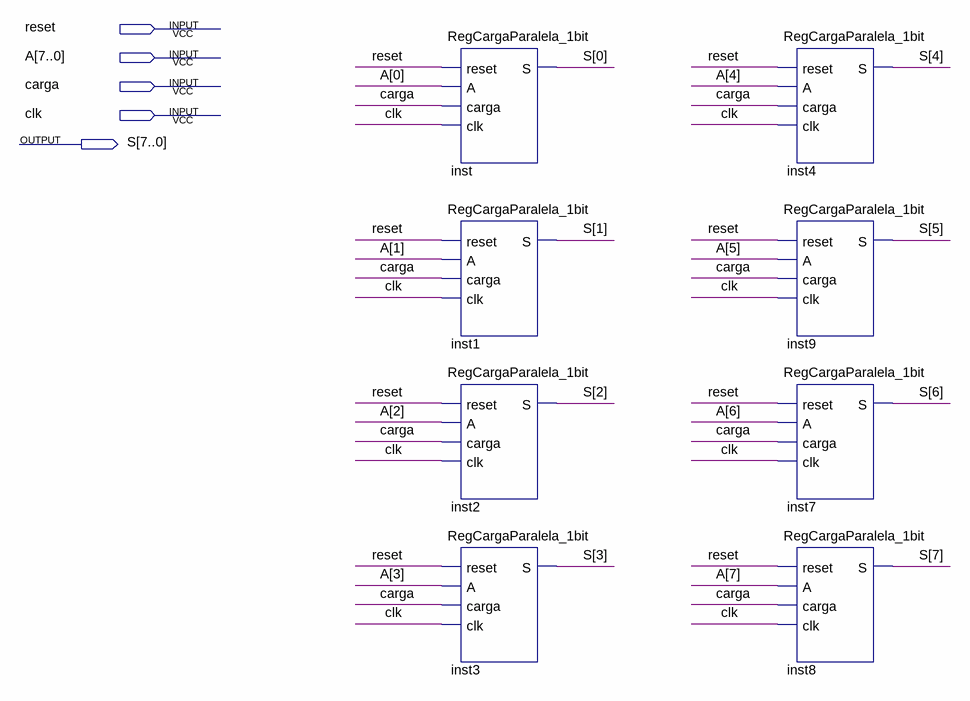
[diagram p0: schematic sheet]
// Quartus schematic RegCargaParalela_8bit.bdf as structural Verilog: 8 symbols, 5 pins
module RegCargaParalela_8bit (
  input  reset,
  input  [7:0] A,
  input  carga,
  input  clk,
  output [7:0] S
);

  RegCargaParalela_1bit inst (.reset(reset), .A(A[0]), .carga(carga), .clk(clk), .S(S[0]));
  RegCargaParalela_1bit inst1 (.reset(reset), .A(A[1]), .carga(carga), .clk(clk), .S(S[1]));
  RegCargaParalela_1bit inst2 (.reset(reset), .A(A[2]), .carga(carga), .clk(clk), .S(S[2]));
  RegCargaParalela_1bit inst3 (.reset(reset), .A(A[3]), .carga(carga), .clk(clk), .S(S[3]));
  RegCargaParalela_1bit inst4 (.reset(reset), .A(A[4]), .carga(carga), .clk(clk), .S(S[4]));
  RegCargaParalela_1bit inst9 (.reset(reset), .A(A[5]), .carga(carga), .clk(clk), .S(S[5]));
  RegCargaParalela_1bit inst7 (.reset(reset), .A(A[6]), .carga(carga), .clk(clk), .S(S[6]));
  RegCargaParalela_1bit inst8 (.reset(reset), .A(A[7]), .carga(carga), .clk(clk), .S(S[7]));
endmodule
